# Altium project COIL-BOOST-10A.PrjPcb (part 1 of 3)
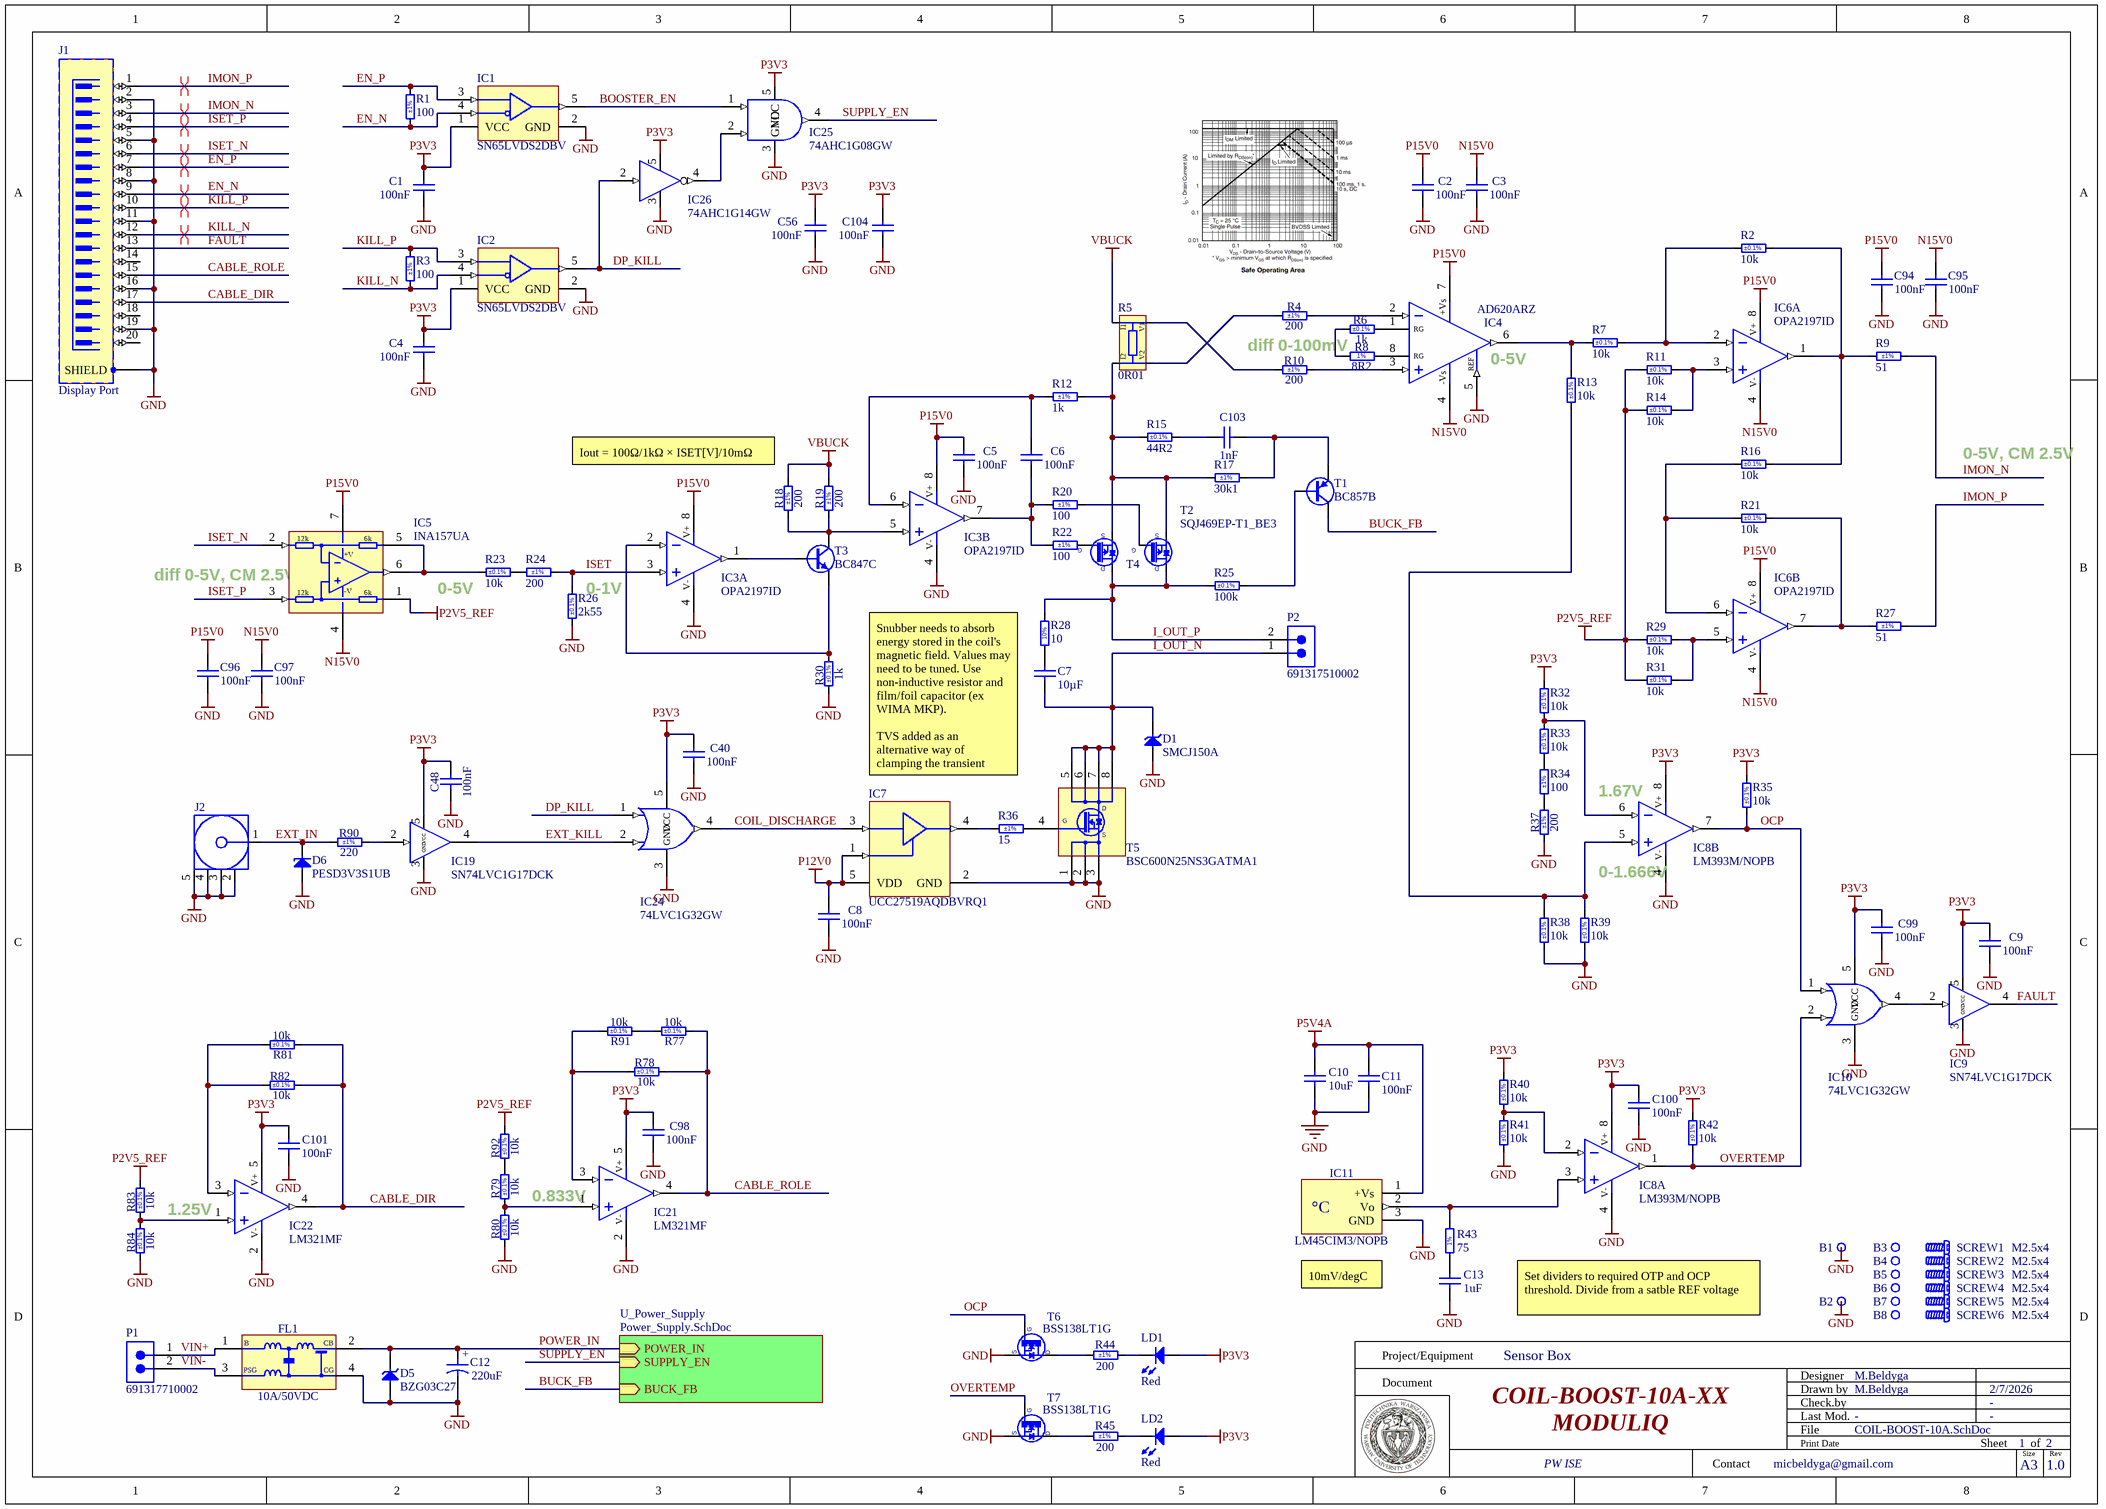
[diagram p0: COIL-BOOST-10A.SchDoc]
CreateDate: 2/7/2026; Revision: 1.0
2 sheets, 269 parts. Net scope: hierarchical (ports join the sheet entries above them; power ports are global).
Board file: COIL-BOOST-10A.PcbDoc
Sheets:
  COIL-BOOST-10A.SchDoc
    U_Power_Supply = Power_Supply.SchDoc

## Sheet COIL-BOOST-10A.SchDoc: COIL-BOOST-10A-XX
size A3; Author: M.Beldyga; CompanyName: WUT ISE; DrawnBy: M.Beldyga; Organization: WUT ISE; Address1: PW ISE; Address2: Nowowiejska 15/19 00-665 Warsaw; Address3: micbeldyga@gmail.com; SheetNumber: 1; SheetTotal: 2; ModifiedBy: -; CheckedDate: -; Title2: MODULIQ; DivGrp: WUT ISE; Designer: M.Beldyga; ModifiedDate: -; ProjectName: Sensor Box

### Parts
B1  Plated Hole  [MTG270_500]  (value not drawn)  (no BOM)
B2  Plated Hole  [MTG270_500]  (value not drawn)  (no BOM)
B3  Plated Hole  [MTG270_500]  (value not drawn)  (no BOM)
B4  Plated Hole  [MTG270_500]  (value not drawn)  (no BOM)
B5  Plated Hole  [MTG270_500]  (value not drawn)  (no BOM)
B6  Plated Hole  [MTG270_500]  (value not drawn)  (no BOM)
B7  Plated Hole  [MTG270_500]  (value not drawn)  (no BOM)
B8  Plated Hole  [MTG270_500]  (value not drawn)  (no BOM)
C1  100nF  [CAPC1005X55N]
C2  100nF  [CAPC1005X55N]
C3  100nF  [CAPC1005X55N]
C4  100nF  [CAPC1005X55N]
C5  100nF  [CAPC1005X55N]
C6  100nF  [CAPC1005X55N]
C7  10µF  [Kemet R71 32x28x14]
C8  100nF  [CAPC1005X55N]
C9  100nF  [CAPC1005X55N]
C10  10uF  [CAPC1608X80N]
C11  100nF  [CAPC1005X55N]
C12  220uF  [CAPAE830X620N]
C13  1uF  [CAPC1005X55N]
C40  100nF  [CAPC1005X55N]
C48  100nF  [CAPC1005X55N]
C56  100nF  [CAPC1005X55N]
C94  100nF  [CAPC1005X55N]
C95  100nF  [CAPC1005X55N]
C96  100nF  [CAPC1005X55N]
C97  100nF  [CAPC1005X55N]
C98  100nF  [CAPC1005X55N]
C99  100nF  [CAPC1005X55N]
C100  100nF  [CAPC1005X55N]
C101  100nF  [CAPC1005X55N]
C103  1nF  [CAPC1005X55N]
C104  100nF  [CAPC1005X55N]
D1  SMCJ150A  [DIOM7959X262N]
D5  BZG03C27  [DIOM5326X230N]
D6  PESD3V3S1UB  [SODFL1608X65N]
FL1  10A/50VDC  [FIL_MURATA_BNX02]
IC1  SN65LVDS2DBV  [SOT95P280X145-5N]
IC2  SN65LVDS2DBV  [SOT95P280X145-5N]
IC3  OPA2197ID  [SOIC127P600X175-8N]  (parts A,B of 2)
IC4  AD620ARZ  [SOIC127P600X175-8N]
IC5  INA157UA  [SOIC127P600X175-8N]
IC6  OPA2197ID  [SOIC127P600X175-8N]  (parts A,B of 2)
IC7  UCC27519AQDBVRQ1  [SOT95P280X145-5N]
IC8  LM393M/NOPB  [SOIC127P600X175-8N]  (parts A,B of 2)
IC9  SN74LVC1G17DCK  [SOT65P210X110-5N]
IC10  74LVC1G32GW  [SOT65P212X110-5N]
IC11  LM45CIM3/NOPB  [SOT95P251X112-3N]
IC19  SN74LVC1G17DCK  [SOT65P210X110-5N]
IC21  LM321MF  [SOT95P280X145-5N]
IC22  LM321MF  [SOT95P280X145-5N]
IC24  74LVC1G32GW  [SOT65P212X110-5N]
IC25  74AHC1G08GW  [SOT65P212X110-5N]
IC26  74AHC1G14GW  [SOT65P212X110-5N]
J1  Display Port  [MOLEX_47272-0001]
J2  60611002111502  [60611002111502]  (value not drawn)
LD1  Red  [LED_AVAGO_HSMC-C120]
LD2  Red  [LED_AVAGO_HSMC-C120]
P1  691317710002  [691317710002]
P2  691317510002  [691317510002]
R1  100  Tolerance: ±1%  [RESC1005X40N]
R2  10k  Tolerance: ±0.1%  [RESC1005X35N]
R3  100  Tolerance: ±1%  [RESC1005X40N]
R4  200  Tolerance: ±1%  [RESC1608X55N]
R5  0R01  [RES_OHMITE_LVK25]
R6  1k  Tolerance: ±0.1%  [RESC1608X55N]
R7  10k  Tolerance: ±0.1%  [RESC1005X35N]
R8  8R2  [RESC1608X55N]
R9  51  Tolerance: ±1%  [RESC1608X55N]
R10  200  Tolerance: ±1%  [RESC1608X55N]
R11  10k  Tolerance: ±0.1%  [RESC1005X35N]
R12  1k  Tolerance: ±1%  [RESC1005X40N]
R13  10k  Tolerance: ±0.1%  [RESC1005X35N]
R14  10k  Tolerance: ±0.1%  [RESC1005X35N]
R15  44R2  Tolerance: ±0.1%  [RESC1608X55N]
R16  10k  Tolerance: ±0.1%  [RESC1005X35N]
R17  30k1  Tolerance: ±1%  [RESC1005X40N]
R18  200  Tolerance: ±1%  [RESC1608X55N]
R19  200  Tolerance: ±1%  [RESC1608X55N]
R20  100  Tolerance: ±1%  [RESC1005X40N]
R21  10k  Tolerance: ±0.1%  [RESC1005X35N]
R22  100  Tolerance: ±1%  [RESC1005X40N]
R23  10k  Tolerance: ±0.1%  [RESC1005X35N]
R24  200  Tolerance: ±1%  [RESC1608X55N]
R25  100k  Tolerance: ±0.1%  [RESC1005X35N]
R26  2k55  Tolerance: ±0.1%  [RESC1608X55N]
R27  51  Tolerance: ±1%  [RESC1608X55N]
R28  10  [RES_OHMITE_OY_mb]
R29  10k  Tolerance: ±0.1%  [RESC1005X35N]
R30  1k  Tolerance: ±0.1%  [RESC1608X55N]
R31  10k  Tolerance: ±0.1%  [RESC1005X35N]
R32  10k  Tolerance: ±0.1%  [RESC1005X35N]
R33  10k  Tolerance: ±0.1%  [RESC1005X35N]
R34  100  Tolerance: ±1%  [RESC1005X40N]
R35  10k  Tolerance: ±0.1%  [RESC1005X35N]
R36  15  Tolerance: ±1%  [RESC3216X65N]
R37  200  Tolerance: ±1%  [RESC1608X55N]
R38  10k  Tolerance: ±0.1%  [RESC1005X35N]
R39  10k  Tolerance: ±0.1%  [RESC1005X35N]
R40  10k  Tolerance: ±0.1%  [RESC1005X35N]
R41  10k  Tolerance: ±0.1%  [RESC1005X35N]
R42  10k  Tolerance: ±0.1%  [RESC1005X35N]
R43  75  [RESC1005X40N]
R44  200  Tolerance: ±1%  [RESC1608X55N]
R45  200  Tolerance: ±1%  [RESC1608X55N]
R77  10k  Tolerance: ±0.1%  [RESC1005X35N]
R78  10k  Tolerance: ±0.1%  [RESC1005X35N]
R79  10k  Tolerance: ±0.1%  [RESC1005X35N]
R80  10k  Tolerance: ±0.1%  [RESC1005X35N]
R81  10k  Tolerance: ±0.1%  [RESC1005X35N]
R82  10k  Tolerance: ±0.1%  [RESC1005X35N]
R83  10k  Tolerance: ±0.1%  [RESC1005X35N]
R84  10k  Tolerance: ±0.1%  [RESC1005X35N]
R90  220  Tolerance: ±1%  [RESC1005X40N]
R91  10k  Tolerance: ±0.1%  [RESC1005X35N]
R92  10k  Tolerance: ±0.1%  [RESC1005X35N]
SCREW1  M2.5x4  [BOSSARD_BN5687-3061587_v]
SCREW2  M2.5x4  [BOSSARD_BN5687-3061587_v]
SCREW3  M2.5x4  [BOSSARD_BN5687-3061587_v]
SCREW4  M2.5x4  [BOSSARD_BN5687-3061587_v]
SCREW5  M2.5x4  [BOSSARD_BN5687-3061587_v]
SCREW6  M2.5x4  [BOSSARD_BN5687-3061587_v]
T1  BC857B  [SOT95P230X110-3N]
T2  SQJ469EP-T1_BE3  [PowerPAK® SO-8L SINGLE]
T3  BC847C  [SOT95P240X110-3N]
T4  SQJ469EP-T1_BE3  [PowerPAK® SO-8L SINGLE]  (value not drawn)
T5  BSC600N25NS3GATMA1  [INFINEON_PG-TDSON-8]
T6  BSS138LT1G  [SOT95P240X110-3N]
T7  BSS138LT1G  [SOT95P240X110-3N]

### Sub-sheets
U_Power_Supply = Power_Supply.SchDoc: SUPPLY_EN (in), POWER_IN (in), BUCK_FB (in)

### Nets
GND: B1.1 B2.1 C1.1 C2.1 C3.1 C4.1 C5.1 C8.1 C9.1 C10.1 C11.1 C12.2 C13.1 C40.1 C48.1 C56.1 C94.1 C95.1 C96.1 C97.1 C98.1 C99.1 C100.1 C101.1 C104.1 D1.2(A) D5.2(A) D6.2(A) FL1.4(CG) IC1.2(GND) IC2.2(GND) IC3.4(V-) IC4.5(REF) IC7.2(GND) IC8.4(V-) IC9.3(GND) IC10.3(GND) IC11.3(GND) IC19.3(GND) IC21.2(V-) IC22.2(V-) IC24.3(GND) IC25.3(GND) IC26.3(GND) J1.2 J1.5 J1.8 J1.11 J1.16 J1.19 J1.SHIELD J2.2(GND) J2.3(GND) J2.4(GND) J2.5(GND) R26.1 R30.1 R37.1 R38.1 R39.1 R41.1 R80.1 R84.1 T5.1(S) T5.2(S) T5.3(S) T6.2(S) T7.2(S)
N15V0: C3.2 C95.2 C97.2 IC4.4(-Vs) IC5.4(-VEE) IC6.4(V-)
P2V5_REF: IC5.1(REF) R11.1 R14.1 R29.1 R31.1 R83.2 R92.2
P3V3: C1.2 C4.2 C9.2 C40.2 C48.2 C56.2 C98.2 C99.2 C100.2 C101.2 C104.2 IC1.1(VCC) IC2.1(VCC) IC8.8(V+) IC9.5(VCC) IC10.5(VCC) IC19.5(VCC) IC21.5(V+) IC22.5(V+) IC24.5(VCC) IC25.5(VCC) IC26.5(VCC) LD1.2(A) LD2.2(A) R32.2 R35.2 R40.2 R42.2
P5V4A: C10.2 C11.2 IC11.1(+Vs)
P12V0: C8.2 IC7.1(ENA) IC7.5(VDD)
P15V0: C2.2 C5.2 C94.2 C96.2 IC3.8(V+) IC4.7(+Vs) IC5.7(+VCC) IC6.8(V+)
VBUCK: R5.I1 R18.2 R19.2
BOOSTER_EN: IC1.5(R) IC25.1(A)
BUCK_FB: T1.3(C) ; sheet U_Power_Supply/BUCK_FB
CABLE_DIR: IC22.4(OUT) J1.17 R81.1 R82.2
CABLE_ROLE: IC21.4(OUT) J1.15 R77.1 R78.2
COIL_DISCHARGE: IC7.3(IN+/IN-) IC24.4(Y)
DP_KILL: IC2.5(R) IC24.1(A) IC26.2(IN)
EN_N: IC1.4(B) J1.9 R1.1
EN_P: IC1.3(A) J1.7 R1.2
EXT_IN: D6.1(C) J2.1(Signal) R90.2
EXT_KILL: IC19.4(OUT) IC24.2(B)
FAULT: IC9.4(OUT) J1.13
I_OUT_N: C7.1 D1.1(C) P2.1 T5.D
I_OUT_P: P2.2 R25.1 R28.2 T2.3(D) T4.3(D)
IMON_N: J1.3 R9.2
IMON_P: J1.1 R27.2
ISET: IC3.3(IN+) R24.2 R26.2
ISET_N: IC5.2(IN-) J1.6
ISET_P: IC5.3(IN+) J1.4
KILL_N: IC2.4(B) J1.12 R3.1
KILL_P: IC2.3(A) J1.10 R3.2
OCP: IC8.7(OUT) IC10.1(A) R35.1 T6.1(G)
OVERTEMP: IC8.1(OUT) IC10.2(B) R42.1 T7.1(G)
POWER_IN: C12.1 D5.1(C) FL1.2(CB) ; sheet U_Power_Supply/POWER_IN
SUPPLY_EN: IC25.4(Y) ; sheet U_Power_Supply/SUPPLY_EN
VIN+: FL1.1(B) P1.1
VIN-: FL1.3(PSG) P1.2
NetC6_1: C6.1 IC3.7(OUT) R20.1 R22.1
NetC6_2: C6.2 IC3.6(IN-) R12.1
NetC7_2: C7.2 R28.1
NetC13_2: C13.2 R43.1
NetC103_1: C103.1 R17.2 T1.2(E)
NetC103_2: C103.2 R15.2
NetIC3_1: IC3.1(OUT) T3.1(B)
NetIC3_2: IC3.2(IN-) R30.2 T3.2(E)
NetIC3_5: IC3.5(IN+) R18.1 R19.1 T3.3(C)
NetIC4_1: IC4.1(-RG) R6.2
NetIC4_2: IC4.2(-IN) R4.2
NetIC4_3: IC4.3(+IN) R10.2
NetIC4_6: IC4.6(Vout) R7.1 R13.2
NetIC4_8: IC4.8(+RG) R8.2
NetIC5_5: IC5.5(SENS) IC5.6(OUT) R23.1
NetIC6_1: IC6.1(OUT) R2.1 R9.1 R16.2
NetIC6_2: IC6.2(IN-) R2.2 R7.2
NetIC6_3: IC6.3(IN+) R11.2 R14.2
NetIC6_5: IC6.5(IN+) R29.2 R31.2
NetIC6_6: IC6.6(IN-) R16.1 R21.2
NetIC6_7: IC6.7(OUT) R21.1 R27.1
NetIC7_4: IC7.4(OUT) R36.1
NetIC8_2: IC8.2(IN-) R40.1 R41.2
NetIC8_3: IC8.3(IN+) IC11.2(Vo) R43.2
NetIC8_5: IC8.5(IN+) R13.1 R38.2 R39.2
NetIC8_6: IC8.6(IN-) R32.1 R33.2
NetIC9_2: IC9.2(IN) IC10.4(Y)
NetIC19_2: IC19.2(IN) R90.1
NetIC21_1: IC21.1(IN+) R79.1 R80.2
NetIC21_3: IC21.3(IN-) R78.1 R91.2
NetIC22_1: IC22.1(IN+) R83.1 R84.2
NetIC22_3: IC22.3(IN-) R81.2 R82.1
NetIC25_2: IC25.2(B) IC26.4(OUT)
NetLD1_1: LD1.1(C) R44.2
NetLD2_1: LD2.1(C) R45.2
NetR4_1: R4.1 R5.V2
NetR5_I2: R5.I2 R12.2 R15.1 R17.1 T2.2(S) T4.2(S)
NetR5_V1: R5.V1 R10.1
NetR6_1: R6.1 R8.1
NetR20_2: R20.2 T2.1(G)
NetR22_2: R22.2 T4.1(G)
NetR23_2: R23.2 R24.1
NetR25_2: R25.2 T1.1(B)
NetR33_1: R33.1 R34.2
NetR34_1: R34.1 R37.2
NetR36_2: R36.2 T5.4(G)
NetR44_1: R44.1 T6.3(D)
NetR45_1: R45.1 T7.3(D)
NetR77_2: R77.2 R91.1
NetR79_2: R79.2 R92.1

Not connected (* = marked no-connect by the designer): B3 1; B4 1; B5 1; B6 1; B7 1; B8 1; J1 14 18 20

### Layout directives
differential pair; net class Analog: IMON_N, IMON_P, ISET_N, ISET_P
differential pair; net class D100: EN_N, EN_P, KILL_N, KILL_P

### Notes on the sheet
- (near R8) diff 0-100mV
- (near IC4) 0-5V
- (near R18) Iout = 100Ω/1kΩ × ISET[V]/10mΩ
- 0-5V, CM 2.5V
- (near IC5) diff 0-5V, CM 2.5V
- (near R23) 0-5V
- (near R26) 0-1V
- Snubber needs to absorb energy stored in the coil's magnetic field. Values may need to be tuned. Use non-inductive resistor and film/foil capacitor (ex WIMA MKP).
  TVS added as an alternative way of clamping the transient
- (near IC8) 1.67V
- (near IC8) 0-1.666V
- 1.25V
- 0.833V
- (near IC11) 10mV/degC
- Set dividers to required OTP and OCP threshold. Divide from a satble REF voltage
- Project/Equipment
- Document
- Designer
- Drawn by
- Check.by
- Contact
- File
- Last Mod.
- Print Date
- Sheet
- Size
- A3
- of
- Rev
- (in symbol AD620ARZ) RG
- (in symbol BSC600N25NS3GATMA1) 5; 6; 7
- (in symbol CAE830-620_220UF_16V_20%) +
- (in symbol INA157UA) 12k; 6k; +V; -V
- (in symbol LM45CIM3/NOPB) °C
- (in symbol R0402_75R_1%_0.0625W_100PPM) 1%
- (in symbol R0603_8R2_1%_0.1W_200PPM) 1%
- (in symbol RCF_10R_10%_2W_-1300±300PPM_OHMITE_OY) 10%